# Altium schematic sheet MPU.SchDoc
size A3; SheetNumber: 5; SheetTotal: 8
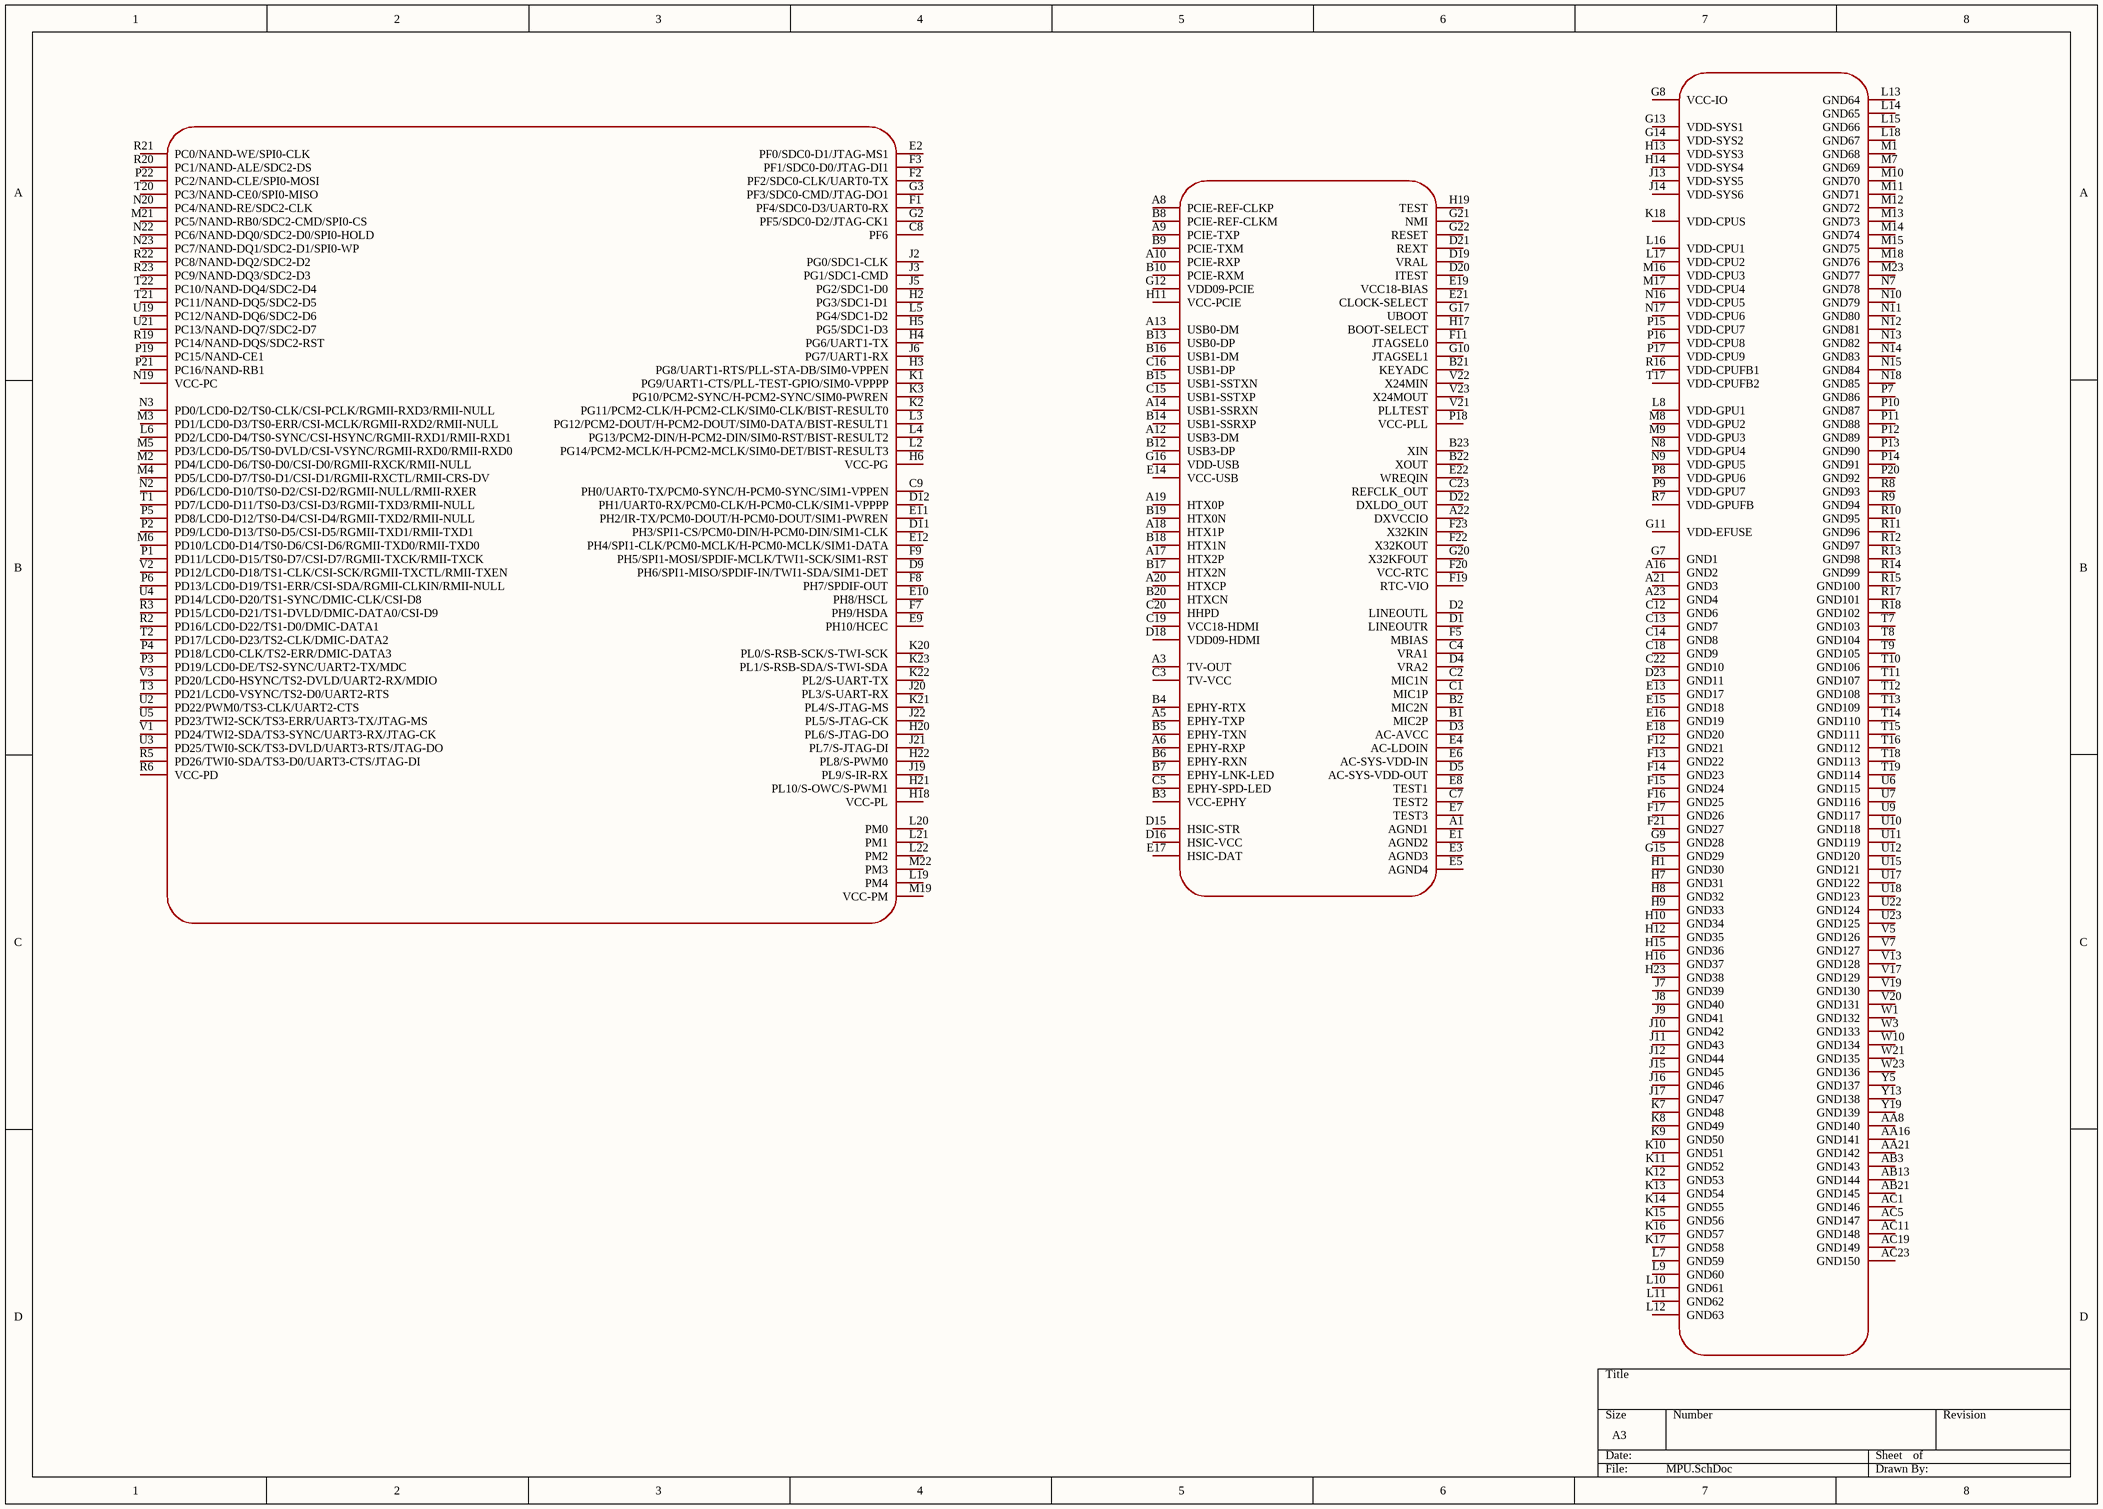
[diagram p0: MPU.SchDoc]

## Parts
U2  Allwinner_H6  [BGA451_ALLWINNER_H6]  (value not drawn)  (parts B,C,D of 4)

## Nets

Not connected (* = marked no-connect by the designer): U2 A1(AGND1) A3(TV-OUT) A5(EPHY-TXP) A6(EPHY-RXP) A8(PCIE-REF-CLKP) A9(PCIE-TXP) A10(PCIE-RXP) A12(USB3-DM) A13(USB0-DM) A14(USB1-SSRXN) A16(GND2) A17(HTX2P) A18(HTX1P) A19(HTX0P) A20(HTXCP) A21(GND3) A22(DXVCCIO) A23(GND4) AA8(GND140) AA16(GND141) AA21(GND142) AB3(GND143) AB13(GND144) AB21(GND145) AC1(GND146) AC5(GND147) AC11(GND148) AC19(GND149) AC23(GND150) B1(MIC2P) B2(MIC2N) B3(VCC-EPHY) B4(EPHY-RTX) B5(EPHY-TXN) B6(EPHY-RXN) B7(EPHY-LNK-LED) B8(PCIE-REF-CLKM) B9(PCIE-TXM) B10(PCIE-RXM) B12(USB3-DP) B13(USB0-DP) B14(USB1-SSRXP) B15(USB1-SSTXN) B16(USB1-DM) B17(HTX2N) B18(HTX1N) B19(HTX0N) B20(HTXCN) B21(KEYADC) B22(XOUT) B23(XIN) C1(MIC1P) C2(MIC1N) C3(TV-VCC) C4(VRA1) C5(EPHY-SPD-LED) C7(TEST2) C8(PF6) C9(PH0/UART0-TX/PCM0-SYNC/H-PCM0-SYNC/SIM1-VPPEN) C12(GND6) C13(GND7) C14(GND8) C15(USB1-SSTXP) C16(USB1-DP) C18(GND9) C19(VCC18-HDMI) C20(HHPD) C22(GND10) C23(REFCLK_OUT) D1(LINEOUTR) D2(LINEOUTL) D3(AC-AVCC) D4(VRA2) D5(AC-SYS-VDD-OUT) D9(PH6/SPI1-MISO/SPDIF-IN/TWI1-SDA/SIM1-DET) D11(PH3/SPI1-CS/PCM0-DIN/H-PCM0-DIN/SIM1-CLK) D12(PH1/UART0-RX/PCM0-CLK/H-PCM0-CLK/SIM1-VPPPP) D15(HSIC-STR) D16(HSIC-VCC) D18(VDD09-HDMI) D19(VRAL) D20(ITEST) D21(REXT) D22(DXLDO_OUT) D23(GND11) E1(AGND2) E2(PF0/SDC0-D1/JTAG-MS1) E3(AGND3) E4(AC-LDOIN) E5(AGND4) E6(AC-SYS-VDD-IN) E7(TEST3) E8(TEST1) E9(PH10/HCEC) E10(PH8/HSCL) E11(PH2/IR-TX/PCM0-DOUT/H-PCM0-DOUT/SIM1-PWREN) E12(PH4/SPI1-CLK/PCM0-MCLK/H-PCM0-MCLK/SIM1-DATA) E13(GND17) E14(VCC-USB) E15(GND18) E16(GND19) E17(HSIC-DAT) E18(GND20) E19(VCC18-BIAS) E21(CLOCK-SELECT) E22(WREQIN) F1(PF4/SDC0-D3/UART0-RX) F2(PF2/SDC0-CLK/UART0-TX) F3(PF1/SDC0-D0/JTAG-DI1) F5(MBIAS) F7(PH9/HSDA) F8(PH7/SPDIF-OUT) F9(PH5/SPI1-MOSI/SPDIF-MCLK/TWI1-SCK/SIM1-RST) F11(JTAGSEL0) F12(GND21) F13(GND22) F14(GND23) F15(GND24) F16(GND25) F17(GND26) F19(RTC-VIO) F20(VCC-RTC) F21(GND27) F22(X32KOUT) F23(X32KIN) G2(PF5/SDC0-D2/JTAG-CK1) G3(PF3/SDC0-CMD/JTAG-DO1) G7(GND1) G8(VCC-IO) G9(GND28) G10(JTAGSEL1) G11(VDD-EFUSE) G12(VDD09-PCIE) G13(VDD-SYS1) G14(VDD-SYS2) G15(GND29) G16(VDD-USB) G17(UBOOT) G20(X32KFOUT) G21(NMI) G22(RESET) H1(GND30) H2(PG3/SDC1-D1) H3(PG8/UART1-RTS/PLL-STA-DB/SIM0-VPPEN) H4(PG6/UART1-TX) H5(PG5/SDC1-D3) H6(VCC-PG) H7(GND31) H8(GND32) H9(GND33) H10(GND34) H11(VCC-PCIE) H12(GND35) H13(VDD-SYS3) H14(VDD-SYS4) H15(GND36) H16(GND37) H17(BOOT-SELECT) H18(VCC-PL) H19(TEST) H20(PL6/S-JTAG-DO) H21(PL10/S-OWC/S-PWM1) H22(PL8/S-PWM0) H23(GND38) J2(PG0/SDC1-CLK) J3(PG1/SDC1-CMD) J5(PG2/SDC1-D0) J6(PG7/UART1-RX) J7(GND39) J8(GND40) J9(GND41) J10(GND42) J11(GND43) J12(GND44) J13(VDD-SYS5) J14(VDD-SYS6) J15(GND45) J16(GND46) J17(GND47) J19(PL9/S-IR-RX) J20(PL3/S-UART-RX) J21(PL7/S-JTAG-DI) J22(PL5/S-JTAG-CK) K1(PG9/UART1-CTS/PLL-TEST-GPIO/SIM0-VPPPP) K2(PG11/PCM2-CLK/H-PCM2-CLK/SIM0-CLK/BIST-RESULT0) K3(PG10/PCM2-SYNC/H-PCM2-SYNC/SIM0-PWREN) K7(GND48) K8(GND49) K9(GND50) K10(GND51) K11(GND52) K12(GND53) K13(GND54) K14(GND55) K15(GND56) K16(GND57) K17(GND58) K18(VDD-CPUS) K20(PL0/S-RSB-SCK/S-TWI-SCK) K21(PL4/S-JTAG-MS) K22(PL2/S-UART-TX) K23(PL1/S-RSB-SDA/S-TWI-SDA) L2(PG14/PCM2-MCLK/H-PCM2-MCLK/SIM0-DET/BIST-RESULT3) L3(PG12/PCM2-DOUT/H-PCM2-DOUT/SIM0-DATA/BIST-RESULT1) L4(PG13/PCM2-DIN/H-PCM2-DIN/SIM0-RST/BIST-RESULT2) L5(PG4/SDC1-D2) L6(PD2/LCD0-D4/TS0-SYNC/CSI-HSYNC/RGMII-RXD1/RMII-RXD1) L7(GND59) L8(VDD-GPU1) L9(GND60) L10(GND61) L11(GND62) L12(GND63) L13(GND64) L14(GND65) L15(GND66) L16(VDD-CPU1) L17(VDD-CPU2) L18(GND67) L19(PM4) L20(PM0) L21(PM1) L22(PM2) M1(GND68) M2(PD4/LCD0-D6/TS0-D0/CSI-D0/RGMII-RXCK/RMII-NULL) M3(PD1/LCD0-D3/TS0-ERR/CSI-MCLK/RGMII-RXD2/RMII-NULL) M4(PD5/LCD0-D7/TS0-D1/CSI-D1/RGMII-RXCTL/RMII-CRS-DV) M5(PD3/LCD0-D5/TS0-DVLD/CSI-VSYNC/RGMII-RXD0/RMII-RXD0) M6(PD10/LCD0-D14/TS0-D6/CSI-D6/RGMII-TXD0/RMII-TXD0) M7(GND69) M8(VDD-GPU2) M9(VDD-GPU3) M10(GND70) M11(GND71) M12(GND72) M13(GND73) M14(GND74) M15(GND75) M16(VDD-CPU3) M17(VDD-CPU4) M18(GND76) M19(VCC-PM) M21(PC5/NAND-RB0/SDC2-CMD/SPI0-CS) M22(PM3) M23(GND77) N2(PD6/LCD0-D10/TS0-D2/CSI-D2/RGMII-NULL/RMII-RXER) N3(PD0/LCD0-D2/TS0-CLK/CSI-PCLK/RGMII-RXD3/RMII-NULL) N7(GND78) N8(VDD-GPU4) N9(VDD-GPU5) N10(GND79) N11(GND80) N12(GND81) N13(GND82) N14(GND83) N15(GND84) N16(VDD-CPU5) N17(VDD-CPU6) N18(GND85) N19(VCC-PC) N20(PC4/NAND-RE/SDC2-CLK) N22(PC6/NAND-DQ0/SDC2-D0/SPI0-HOLD) N23(PC7/NAND-DQ1/SDC2-D1/SPI0-WP) P1(PD11/LCD0-D15/TS0-D7/CSI-D7/RGMII-TXCK/RMII-TXCK) P2(PD9/LCD0-D13/TS0-D5/CSI-D5/RGMII-TXD1/RMII-TXD1) P3(PD19/LCD0-DE/TS2-SYNC/UART2-TX/MDC) P4(PD18/LCD0-CLK/TS2-ERR/DMIC-DATA3) P5(PD8/LCD0-D12/TS0-D4/CSI-D4/RGMII-TXD2/RMII-NULL) P6(PD13/LCD0-D19/TS1-ERR/CSI-SDA/RGMII-CLKIN/RMII-NULL) P7(GND86) P8(VDD-GPU6) P9(VDD-GPU7) P10(GND87) P11(GND88) P12(GND89) P13(GND90) P14(GND91) P15(VDD-CPU7) P16(VDD-CPU8) P17(VDD-CPU9) P18(VCC-PLL) P19(PC15/NAND-CE1) P20(GND92) P21(PC16/NAND-RB1) P22(PC2/NAND-CLE/SPI0-MOSI) R2(PD16/LCD0-D22/TS1-D0/DMIC-DATA1) R3(PD15/LCD0-D21/TS1-DVLD/DMIC-DATA0/CSI-D9) R5(PD26/TWI0-SDA/TS3-D0/UART3-CTS/JTAG-DI) R6(VCC-PD) R7(VDD-GPUFB) R8(GND93) R9(GND94) R10(GND95) R11(GND96) R12(GND97) R13(GND98) R14(GND99) R15(GND100) R16(VDD-CPUFB1) R17(GND101) R18(GND102) R19(PC14/NAND-DQS/SDC2-RST) R20(PC1/NAND-ALE/SDC2-DS) R21(PC0/NAND-WE/SPI0-CLK) R22(PC8/NAND-DQ2/SDC2-D2) R23(PC9/NAND-DQ3/SDC2-D3) T1(PD7/LCD0-D11/TS0-D3/CSI-D3/RGMII-TXD3/RMII-NULL) T2(PD17/LCD0-D23/TS2-CLK/DMIC-DATA2) T3(PD21/LCD0-VSYNC/TS2-D0/UART2-RTS) T7(GND103) T8(GND104) T9(GND105) T10(GND106) T11(GND107) T12(GND108) T13(GND109) T14(GND110) T15(GND111) T16(GND112) T17(VDD-CPUFB2) T18(GND113) T19(GND114) T20(PC3/NAND-CE0/SPI0-MISO) T21(PC11/NAND-DQ5/SDC2-D5) T22(PC10/NAND-DQ4/SDC2-D4) U2(PD22/PWM0/TS3-CLK/UART2-CTS) U3(PD25/TWI0-SCK/TS3-DVLD/UART3-RTS/JTAG-DO) U4(PD14/LCD0-D20/TS1-SYNC/DMIC-CLK/CSI-D8) U5(PD23/TWI2-SCK/TS3-ERR/UART3-TX/JTAG-MS) U6(GND115) U7(GND116) U9(GND117) U10(GND118) U11(GND119) U12(GND120) U15(GND121) U17(GND122) U18(GND123) U19(PC12/NAND-DQ6/SDC2-D6) U21(PC13/NAND-DQ7/SDC2-D7) U22(GND124) U23(GND125) V1(PD24/TWI2-SDA/TS3-SYNC/UART3-RX/JTAG-CK) V2(PD12/LCD0-D18/TS1-CLK/CSI-SCK/RGMII-TXCTL/RMII-TXEN) V3(PD20/LCD0-HSYNC/TS2-DVLD/UART2-RX/MDIO) V5(GND126) V7(GND127) V13(GND128) V17(GND129) V19(GND130) V20(GND131) V21(PLLTEST) V22(X24MIN) V23(X24MOUT) W1(GND132) W3(GND133) W10(GND134) W21(GND135) W23(GND136) Y5(GND137) Y13(GND138) Y19(GND139)

## Library data of the parts
U2 = Allwinner_H6: Add into BOM: yes; Symbol: Allwinner_H6; Device: Allwinner_H6; Convert to PCB: yes